# Altium schematic sheet MASTER.SchDoc
size A4; SheetNumber: 2; SheetTotal: 7
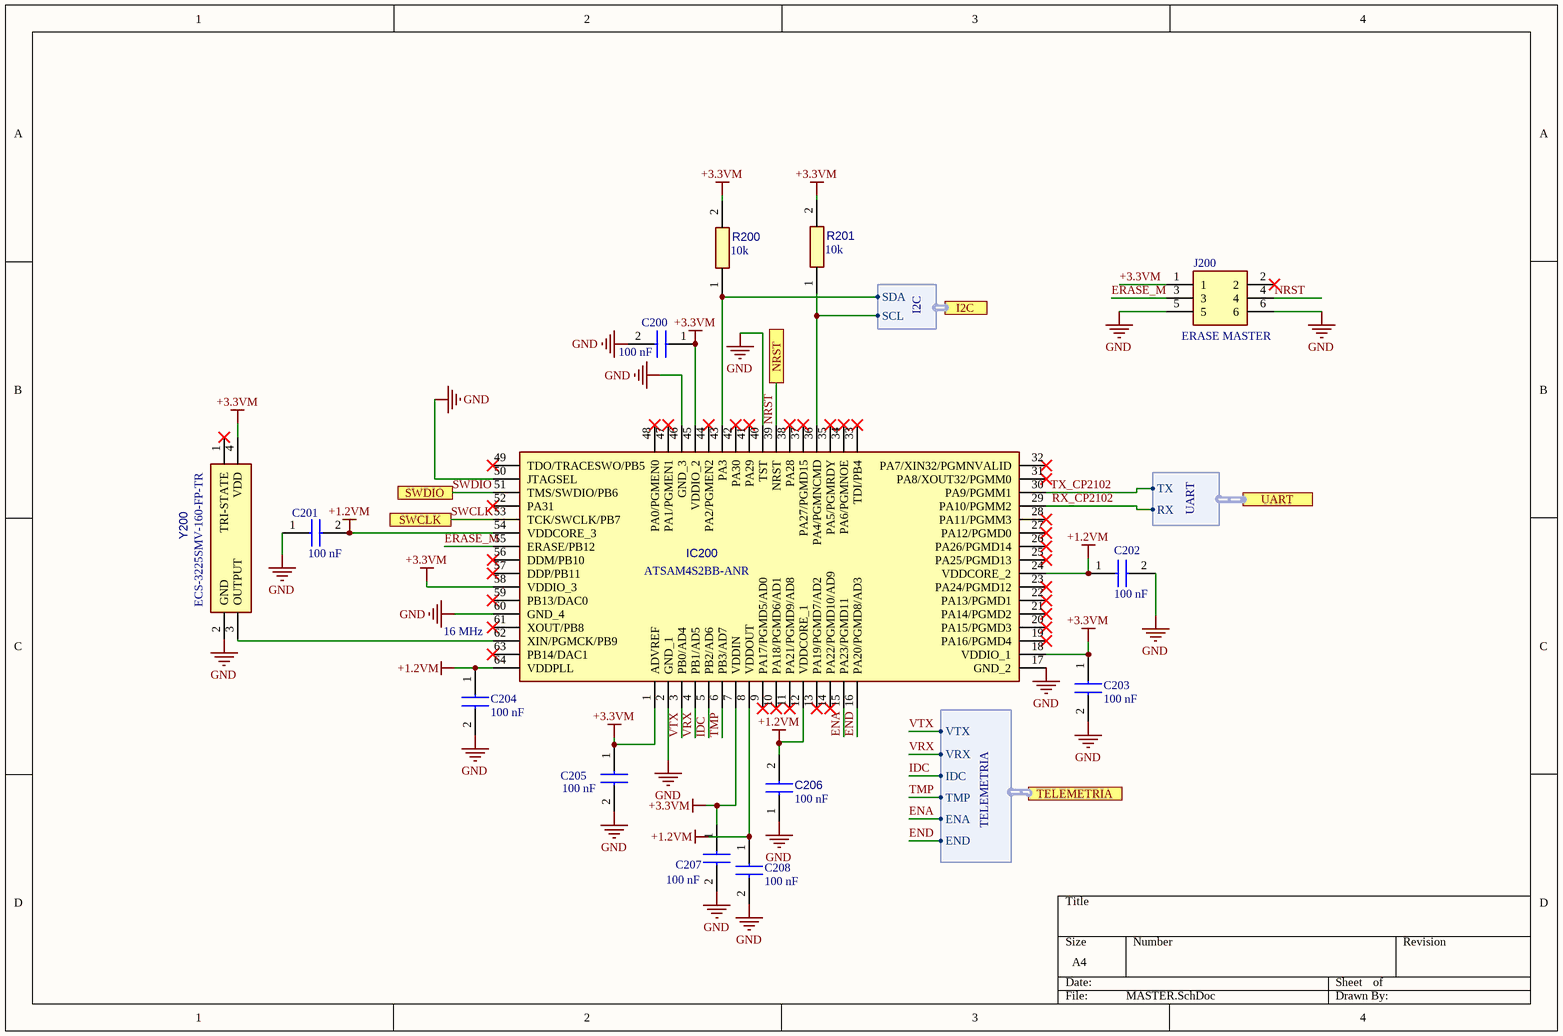
[diagram p0: MASTER.SchDoc]

## Parts
C200  100 nF  [C0603]
C201  100 nF  [C0603]
C202  100 nF  [C0603]
C203  100 nF  [C0603]
C204  100 nF  [C0603]
C205  100 nF  [C0603]
C206  100 nF  [C0603]
C207  100 nF  [C0603]
C208  100 nF  [C0603]
IC200  ATSAM4S2BB-ANR  [QFN50P905X905X75-65N]
J200  ERASE MASTER  [HDRV6W64P254_2X3_762X508X889P]
R200  10k  [RESC1608X55N]
R201  10k  [RESC1608X55N]
Y200  ECS-3225SMV-160-FP-TR  [ECS3225SMV160FPTR]

## Ports
I2C (harness I2C), NRST, SWCLK, SWDIO, TELEMETRIA (harness TELEMETRIA), UART (harness UART)

## Harnesses
I2C: SDA, SCL
UART: TX, RX
TELEMETRIA: VTX, VRX, IDC, TMP, ENA, END

## Nets
+1.2VM: C201.2 C202.1 C204.1 C206.2 C208.1 IC200.8(VDDOUT) IC200.12(VDDCORE_1) IC200.24(VDDCORE_2) IC200.54(VDDCORE_3) IC200.64(VDDPLL)
+3.3VM: C200.1 C203.1 C205.1 C207.1 IC200.1(ADVREF) IC200.7(VDDIN) IC200.18(VDDIO_1) IC200.45(VDDIO_2) IC200.58(VDDIO_3) J200.1 R200.2 R201.2 Y200.4(VDD)
GND: C200.2 C201.1 C202.2 C203.2 C204.2 C205.2 C206.1 C207.2 C208.2 IC200.2(GND_1) IC200.17(GND_2) IC200.40(TST) IC200.46(GND_3) IC200.50(JTAGSEL) IC200.60(GND_4) J200.5 J200.6 Y200.2(GND)
ENA: IC200.15(PA23/PGMD11) ; port TELEMETRIA.ENA
END: IC200.16(PA20/PGMD8/AD3) ; port TELEMETRIA.END
ERASE_M: IC200.55(ERASE/PB12) J200.3
IDC: IC200.5(PB2/AD6) ; port TELEMETRIA.IDC
NRST: IC200.39(NRST) J200.4 ; port NRST
RX_CP2102: IC200.29(PA10/PGMM2) ; port UART.RX
SWCLK: IC200.53(TCK/SWCLK/PB7) ; port SWCLK
SWDIO: IC200.51(TMS/SWDIO/PB6) ; port SWDIO
TMP: IC200.6(PB3/AD7) ; port TELEMETRIA.TMP
TX_CP2102: IC200.30(PA9/PGMM1) ; port UART.TX
VRX: IC200.4(PB1/AD5) ; port TELEMETRIA.VRX
VTX: IC200.3(PB0/AD4) ; port TELEMETRIA.VTX
NetIC200_36: IC200.36(PA4/PGMNCMD) R201.1 ; port I2C.SCL
NetIC200_43: IC200.43(PA3) R200.1 ; port I2C.SDA
NetIC200_62: IC200.62(XIN/PGMCK/PB9) Y200.3(OUTPUT)

Not connected (* = marked no-connect by the designer): IC200 9(PA17/PGMD5/AD0)* 10(PA18/PGMD6/AD1)* 11(PA21/PGMD9/AD8)* 13(PA19/PGMD7/AD2)* 14(PA22/PGMD10/AD9)* 19(PA16/PGMD4)* 20(PA15/PGMD3)* 21(PA14/PGMD2)* 22(PA13/PGMD1)* 23(PA24/PGMD12)* 25(PA25/PGMD13)* 26(PA26/PGMD14)* 27(PA12/PGMD0)* 28(PA11/PGMM3)* 31(PA8/XOUT32/PGMM0)* 32(PA7/XIN32/PGMNVALID)* 33(TDI/PB4)* 34(PA6/PGMNOE)* 35(PA5/PGMRDY)* 37(PA27/PGMD15)* 38(PA28)* 41(PA29)* 42(PA30)* 44(PA2/PGMEN2)* 47(PA1/PGMEN1)* 48(PA0/PGMEN0)* 49(TDO/TRACESWO/PB5)* 52(PA31)* 56(DDM/PB10)* 57(DDP/PB11)* 59(PB13/DAC0)* 61(XOUT/PB8)* 63(PB14/DAC1)*; J200 2*; Y200 1(TRI-STATE)*

## Notes on the sheet
- 16 MHz

## Library data of the parts
C200-C208 = C0603H470J5GACTU: Capacitor; Manufacturer_Name: KEMET; Datasheet Link: https://content.kemet.com/datasheets/KEM_C1001_C0G_200C_SMD.pdf; Height: 0.87mm; Manufacturer_Part_Number: C0603H470J5GACTU
IC200 = ATSAM4S2BB-ANR: Integrated Circuit; Manufacturer_Name: Microchip; Datasheet Link: https://www.arrow.com/en/products/atsam4s2bb-anr/microchip-technology; Height: 1.6mm; Manufacturer_Part_Number: ATSAM4S2BB-ANR; Mouser Part Number: 556-ATSAM4S2BB-ANR; Mouser Price/Stock: https://www.mouser.co.uk/ProductDetail/Microchip-Technology/ATSAM4S2BB-ANR?qs=YCa%2FAAYMW01XwEtU%252BP2dsA%3D%3D; Arrow Part Number: ATSAM4S2BB-ANR; Arrow Price/Stock: https://www.arrow.com/en/products/atsam4s2bb-anr/microchip-technology
J200 = 61300621121: Connector; Manufacturer_Name: Wurth Elektronik; Height: 8.89mm; Manufacturer_Part_Number: 61300621121; Mouser Part Number: 710-61300621121; Mouser Price/Stock: https://www.mouser.co.uk/ProductDetail/Wurth-Elektronik/61300621121?qs=PhR8RmCirEb94hrEcn0AQg%3D%3D
R200 R201 = CR0603-FX-1431ELF: Resistor; Manufacturer_Name: Bourns; Datasheet Link: https://www.bourns.com/pdfs/chpreztr.pdf; Height: 0.55mm; Manufacturer_Part_Number: CR0603-FX-1431ELF; Mouser Part Number: 652-CR0603FX-1431ELF; Mouser Price/Stock: https://www.mouser.co.uk/ProductDetail/Bourns/CR0603-FX-1431ELF?qs=e7cxVwPieurCzASkAzK2%252Bg%3D%3D
Y200 = ECS-3225SMV-160-FP-TR: Crystal or Oscillator; Manufacturer_Name: ECS; Datasheet Link: https://datasheet.datasheetarchive.com/originals/distributors/Datasheets_SAMA/aca54b4a763fa6b74cd8d2921d99cf9f.pdf; Height: 1.2mm; Manufacturer_Part_Number: ECS-3225SMV-160-FP-TR; Mouser Part Number: 520-3225SMV-160-FPT; Mouser Price/Stock: https://www.mouser.co.uk/ProductDetail/ECS/ECS-3225SMV-160-FP-TR?qs=%252B6g0mu59x7IhPTRSFb%2Fsjg%3D%3D; Arrow Part Number: ECS-3225SMV-160-FP-TR; Arrow Price/Stock: https://www.arrow.com/en/products/ecs-3225smv-160-fp-tr/ecs-international?region=nac